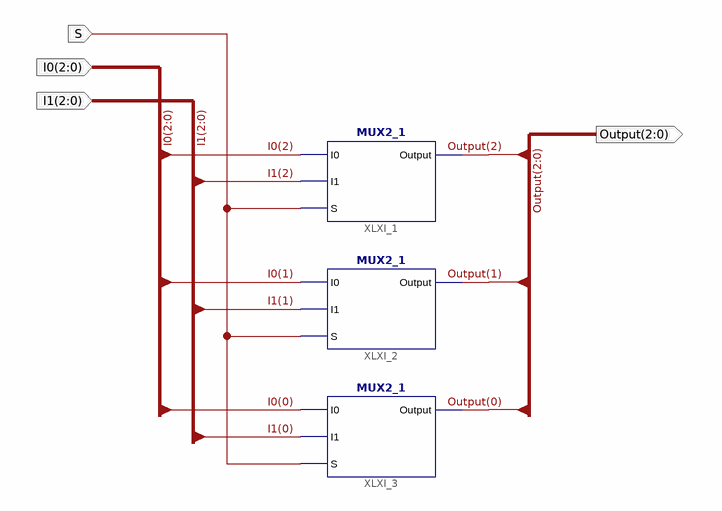
[diagram p0: schematic sheet 1]
// Xilinx ISE schematic MUX2_1_3bits.sch (virtex6) as structural Verilog: 3 symbols, 4 ports
module MUX2_1_3bits (
  input  [2:0] I0,
  input  [2:0] I1,
  input  S,
  output [2:0] Output
);

  MUX2_1 XLXI_1 (.I0(I0[2]), .I1(I1[2]), .Output(Output[2]), .S(S));
  MUX2_1 XLXI_2 (.I0(I0[1]), .I1(I1[1]), .Output(Output[1]), .S(S));
  MUX2_1 XLXI_3 (.I0(I0[0]), .I1(I1[0]), .Output(Output[0]), .S(S));
endmodule
